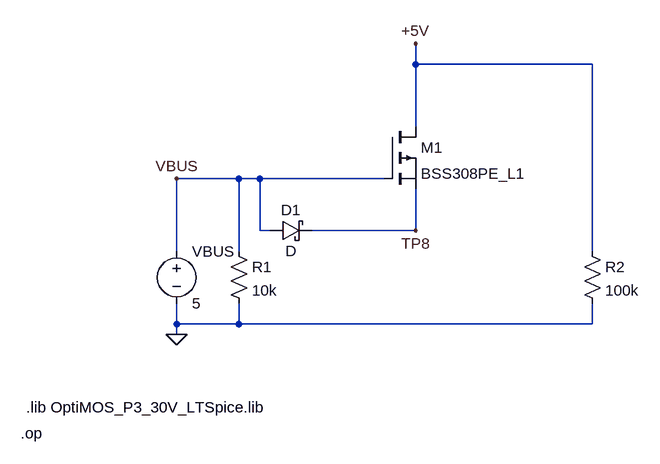
[diagram p0: schematic PMOSLeakage.asc]
PMOSLeakage.asc, the LTspice schematic file:
Version 4
SHEET 1 1252 804
WIRE 288 -32 288 -64
WIRE 560 -32 288 -32
WIRE 288 64 288 -32
WIRE 16 144 -80 144
WIRE 48 144 16 144
WIRE 240 144 48 144
WIRE 48 224 48 144
WIRE 64 224 48 224
WIRE 288 224 288 160
WIRE 288 224 128 224
WIRE -80 256 -80 144
WIRE 16 256 16 144
WIRE 560 256 560 -32
WIRE -80 368 -80 336
WIRE 16 368 16 336
WIRE 16 368 -80 368
WIRE 560 368 560 336
WIRE 560 368 16 368
WIRE -80 384 -80 368
FLAG -80 384 0
FLAG -80 144 VBUS
FLAG 288 -64 +5V
FLAG 288 224 TP8
SYMBOL voltage -80 240 R0
WINDOW 123 0 0 Left 0
WINDOW 39 0 0 Left 0
SYMATTR InstName VBUS
SYMATTR Value 5
SYMBOL schottky 64 240 R270
WINDOW 0 32 32 VTop 2
WINDOW 3 0 32 VBottom 2
SYMATTR InstName D1
SYMBOL res 0 240 R0
SYMATTR InstName R1
SYMATTR Value 10k
SYMBOL pmos 240 64 R0
SYMATTR InstName M1
SYMATTR Value BSS308PE_L1
SYMATTR Prefix X
SYMBOL res 544 240 R0
SYMATTR InstName R2
SYMATTR Value 100k
TEXT -320 536 Left 2 !.op
TEXT -312 496 Left 2 !.lib OptiMOS_P3_30V_LTSpice.lib

The netlist it stands for:
* PMOSLeakage.asc
VBUS VBUS 0 5
D1 VBUS TP8 D
R1 VBUS 0 10k
XM1 +5V VBUS TP8 BSS308PE_L1  ; pins D G S
R2 +5V 0 100k
.model D D
.lib standard.dio
.op
.lib OptiMOS_P3_30V_LTSpice.lib
.backanno
.end

* Results of the author's LTspice run, read from the files saved beside the schematic
* Operating Point:
*   V(vbus) = 5 V
*   V(tp8) = 4.627 V
*   V(+5v) = 1.853 mV
*   I(D1) = 18.16 nA
*   I(R1) = 500 µA
*   I(R2) = 18.53 nA
*   I(Vbus) = -500 µA
*   Ix(m1:DRAIN) = -18.53 nA
*   Ix(m1:GATE) = 372.8 pA
*   Ix(m1:SOURCE) = 18.16 nA
* From the log:
*   Semiconductor Device Operating Points:
*                           --- Diodes ---
*   Name:      d1
*   Model:      d
*   Id:      1.82e-08
*   Vd:      3.73e-01
*   Req:     1.42e+06
*   CAP:     0.00e+00